# Altium project Robin_v0.PrjPcb
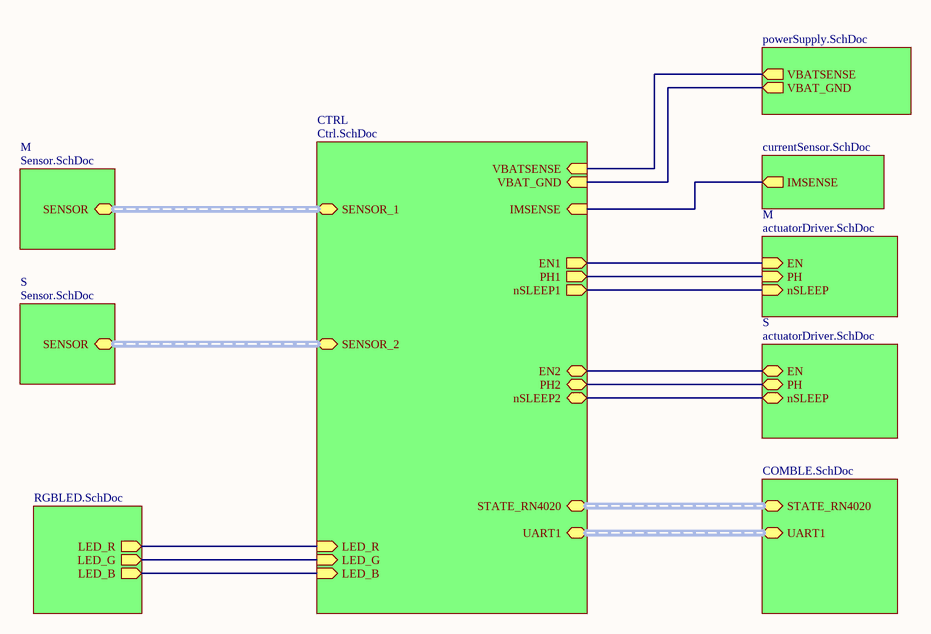
[diagram p0: Robin_v0.SchDoc]
8 sheets, 106 parts. Net scope: hierarchical (ports join the sheet entries above them; power ports are global).
Board files: PCB1.PcbDoc, PCB2.PcbDoc
Sheets:
  Robin_v0.SchDoc
    CTRL = Ctrl.SchDoc
     = powerSupply.SchDoc
    M = actuatorDriver.SchDoc
    S = actuatorDriver.SchDoc
    S = Sensor.SchDoc
    M = Sensor.SchDoc
     = COMBLE.SchDoc
     = currentSensor.SchDoc
     = RGBLED.SchDoc

## Sheet Robin_v0.SchDoc
size A4

### Sub-sheets
CTRL = Ctrl.SchDoc: STATE_RN4020 (harness STATE_RN4020), VBATSENSE (in), VBAT_GND (in), EN1 (out), PH1 (out), nSLEEP1 (out), EN2, PH2, nSLEEP2, IMSENSE (in), UART1 (harness UART1), SENSOR_1 (harness SENSOR_1), SENSOR_2 (harness SENSOR_2), LED_R (in), LED_B (in), LED_G (in)
M = actuatorDriver.SchDoc: EN (in), PH (in), nSLEEP (in)
M = Sensor.SchDoc: SENSOR (harness SENSOR_1)
S = actuatorDriver.SchDoc: EN, PH, nSLEEP
S = Sensor.SchDoc: SENSOR (harness SENSOR_2)
? = powerSupply.SchDoc: VBATSENSE (out), VBAT_GND (out)
? = COMBLE.SchDoc: STATE_RN4020 (harness STATE_RN4020), UART1 (harness UART1)
? = currentSensor.SchDoc: IMSENSE (out)
? = RGBLED.SchDoc: LED_R (out), LED_G (out), LED_B (out)

### Nets
EN: sheet CTRL/EN1, sheet M/EN
EN: sheet CTRL/EN2, sheet S/EN  [a separate net that carries the same name]
IMSENSE: sheet CTRL/IMSENSE, sheet /IMSENSE
LED_B: sheet CTRL/LED_B, sheet /LED_B
LED_G: sheet CTRL/LED_G, sheet /LED_G
LED_R: sheet CTRL/LED_R, sheet /LED_R
nSLEEP: sheet CTRL/nSLEEP1, sheet M/nSLEEP
nSLEEP: sheet CTRL/nSLEEP2, sheet S/nSLEEP  [a separate net that carries the same name]
PH: sheet CTRL/PH1, sheet M/PH
PH: sheet CTRL/PH2, sheet S/PH  [a separate net that carries the same name]
VBAT_GND: sheet CTRL/VBAT_GND, sheet /VBAT_GND
VBATSENSE: sheet CTRL/VBATSENSE, sheet /VBATSENSE

### Buses and harness runs
harness sheet /STATE_RN4020 = sheet CTRL/STATE_RN4020
harness sheet /UART1 = sheet CTRL/UART1
harness sheet CTRL/SENSOR_1 = sheet M/SENSOR
harness sheet CTRL/SENSOR_2 = sheet S/SENSOR

## Sheet Ctrl.SchDoc
size A4
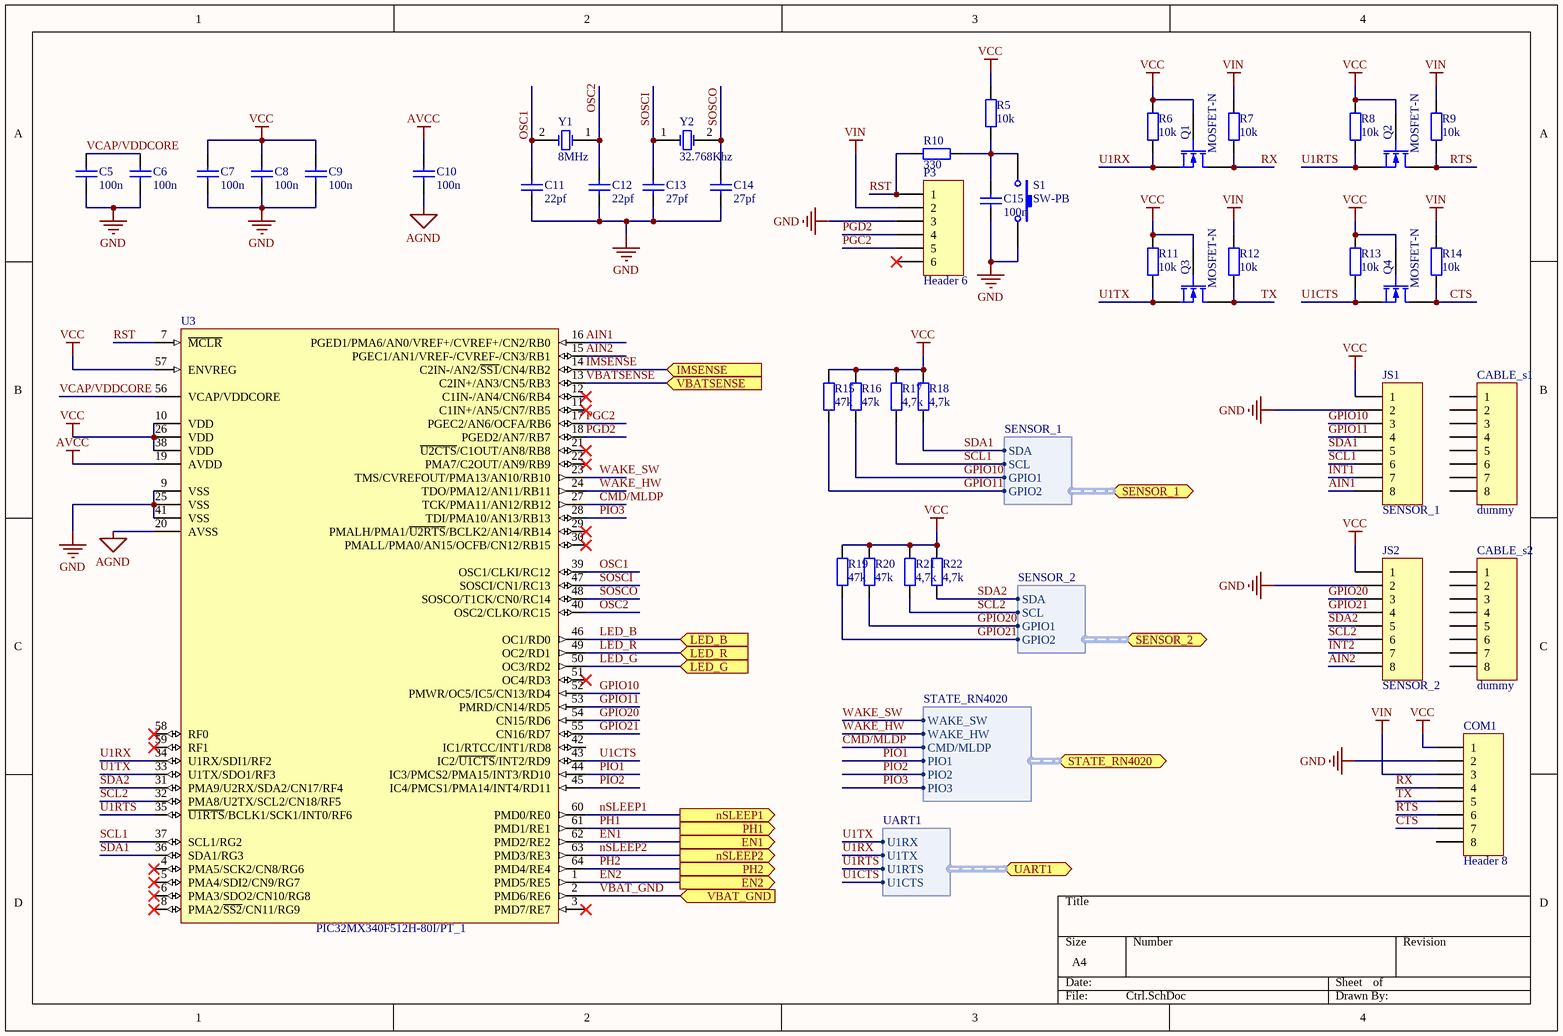
[diagram p1: Ctrl.SchDoc]

### Parts
C5  100n  [RES 0603/1608]
C6  100n  [RES 0603/1608]
C7  100n  [RES 0603/1608]
C8  100n  [RES 0603/1608]
C9  100n  [RES 0603/1608]
C10  100n  [RES 0603/1608]
C11  22pf  [RES 0603/1608]
C12  22pf  [RES 0603/1608]
C13  27pf  [RES 0603/1608]
C14  27pf  [RES 0603/1608]
C15  100n  [RES 0603/1608]
CABLE_s1  dummy
CABLE_s2  dummy
COM1  Header 8  [7-215460-8]
JS1  SENSOR_1  [7-215460-8]
JS2  SENSOR_2  [7-215460-8]
P3  Header 6  [HDR1X6]
Q1  MOSFET-N  [SOT-23]
Q2  MOSFET-N  [SOT-23]
Q3  MOSFET-N  [SOT-23]
Q4  MOSFET-N  [SOT-23]
R5  10k  [RES 0603/1608]
R6  10k  [RES 0603/1608]
R7  10k  [RES 0603/1608]
R8  10k  [RES 0603/1608]
R9  10k  [RES 0603/1608]
R10  330  [RES 0603/1608]
R11  10k  [RES 0603/1608]
R12  10k  [RES 0603/1608]
R13  10k  [RES 0603/1608]
R14  10k  [RES 0603/1608]
R15  47k  [RES 0603/1608]
R16  47k  [RES 0603/1608]
R17  4,7k  [RES 0603/1608]
R18  4,7k  [RES 0603/1608]
R19  47k  [RES 0603/1608]
R20  47k  [RES 0603/1608]
R21  4,7k  [RES 0603/1608]
R22  4,7k  [RES 0603/1608]
S1  SW-PB  [Button]
U3  PIC32MX340F512H-80I/PT_1  [TSQFP50P1200X1200X120-64N]
Y1  8MHz  [XTAL_HC-49/SM]
Y2  32.768Khz  [XTAL_AB26T]

### Ports
EN1 (out), EN2 (out), IMSENSE (in), LED_B (in), LED_G (in), LED_R (in), nSLEEP1 (out), nSLEEP2 (out), PH1 (out), PH2 (out), SENSOR_1 (harness SENSOR_1), SENSOR_2 (harness SENSOR_2), STATE_RN4020 (harness STATE_RN4020), UART1 (harness UART1), VBAT_GND (in), VBATSENSE (in)

### Harnesses
SENSOR_1: SDA, SCL, GPIO1, GPIO2
SENSOR_2: SDA, SCL, GPIO1, GPIO2
STATE_RN4020: WAKE_SW, CMD/MLDP, WAKE_HW, PIO1, PIO3, PIO2
UART1: U1RX, U1TX, U1RTS, U1CTS

### Nets
AGND: C10.2 U3.20(AVSS)
AVCC: C10.1 U3.19(AVDD)
GND: C5.2 C6.2 C7.2 C8.2 C9.2 C11.2 C12.2 C13.2 C14.2 C15.2 COM1.2 JS1.2 JS2.2 P3.3 S1.2 U3.9(VSS) U3.25(VSS) U3.41(VSS)
VCC: C7.1 C8.1 C9.1 COM1.1 JS1.1 JS2.1 Q1.2(G) Q2.2(G) Q3.2(G) Q4.2(G) R5.2 R6.2 R8.2 R11.2 R13.2 R15.2 R16.2 R17.2 R18.2 R19.2 R20.2 R21.2 R22.2 U3.10(VDD) U3.26(VDD) U3.38(VDD) U3.57(ENVREG)
VIN: COM1.3 P3.2 R7.2 R9.2 R12.2 R14.2
AIN1: JS1.8 U3.16(PGED1/PMA6/AN0/VREF+/CVREF+/CN2/RB0)
AIN2: JS2.8 U3.15(PGEC1/AN1/VREF-/CVREF-/CN3/RB1)
CMD/MLDP: U3.27(TCK/PMA11/AN12/RB12) ; port STATE_RN4020.CMD/MLDP
CTS: COM1.7 Q4.1(D) R14.1
EN1: U3.62(PMD2/RE2) ; port EN1  [project net EN]
EN2: U3.1(PMD5/RE5) ; port EN2  [project net EN]
GPIO10: JS1.3 R16.1 U3.52(PMWR/OC5/IC5/CN13/RD4) ; port SENSOR_1.GPIO1
GPIO11: JS1.4 R15.1 U3.53(PMRD/CN14/RD5) ; port SENSOR_1.GPIO2
GPIO20: JS2.3 R20.1 U3.54(CN15/RD6) ; port SENSOR_2.GPIO1
GPIO21: JS2.4 R19.1 U3.55(CN16/RD7) ; port SENSOR_2.GPIO2
IMSENSE: U3.14(C2IN-/AN2/~{SS1}/CN4/RB2) ; port IMSENSE
INT1: JS1.7
INT2: JS2.7
LED_B: U3.46(OC1/RD0) ; port LED_B
LED_G: U3.50(OC3/RD2) ; port LED_G
LED_R: U3.49(OC2/RD1) ; port LED_R
nSLEEP1: U3.60(PMD0/RE0) ; port nSLEEP1  [project net nSLEEP]
nSLEEP2: U3.63(PMD3/RE3) ; port nSLEEP2  [project net nSLEEP]
OSC1: C11.1 U3.39(OSC1/CLKI/RC12) Y1.2(OSC2)
OSC2: C12.1 U3.40(OSC2/CLKO/RC15) Y1.1(OSC1)
PGC2: P3.5 U3.17(PGEC2/AN6/OCFA/RB6)
PGD2: P3.4 U3.18(PGED2/AN7/RB7)
PH1: U3.61(PMD1/RE1) ; port PH1  [project net PH]
PH2: U3.64(PMD4/RE4) ; port PH2  [project net PH]
PIO1: U3.44(IC3/PMCS2/PMA15/INT3/RD10) ; port STATE_RN4020.PIO1
PIO2: U3.45(IC4/PMCS1/PMA14/INT4/RD11) ; port STATE_RN4020.PIO2
PIO3: U3.28(TDI/PMA10/AN13/RB13) ; port STATE_RN4020.PIO3
RST: P3.1 R10.1 U3.7(~{MCLR})
RTS: COM1.6 Q2.1(D) R9.1
RX: COM1.4 Q1.1(D) R7.1
SCL1: JS1.6 R17.1 U3.37(SCL1/RG2) ; port SENSOR_1.SCL
SCL2: JS2.6 R21.1 U3.32(PMA8/U2TX/SCL2/CN18/RF5) ; port SENSOR_2.SCL
SDA1: JS1.5 R18.1 U3.36(SDA1/RG3) ; port SENSOR_1.SDA
SDA2: JS2.5 R22.1 U3.31(PMA9/U2RX/SDA2/CN17/RF4) ; port SENSOR_2.SDA
SOSCI: C13.1 U3.47(SOSCI/CN1/RC13) Y2.1(OSC1)
SOSCO: C14.1 U3.48(SOSCO/T1CK/CN0/RC14) Y2.2(OSC2)
TX: COM1.5 Q3.1(D) R12.1
U1CTS: Q4.3(S) R13.1 U3.43(IC2/~{U1CTS}/INT2/RD9) ; port UART1.U1CTS
U1RTS: Q2.3(S) R8.1 U3.35(~{U1RTS}/BCLK1/SCK1/INT0/RF6) ; port UART1.U1RTS
U1RX: Q1.3(S) R6.1 U3.34(U1RX/SDI1/RF2) ; port UART1.U1TX
U1TX: Q3.3(S) R11.1 U3.33(U1TX/SDO1/RF3) ; port UART1.U1RX
VBAT_GND: U3.2(PMD6/RE6) ; port VBAT_GND
VBATSENSE: U3.13(C2IN+/AN3/CN5/RB3) ; port VBATSENSE
VCAP/VDDCORE: C5.1 C6.1 U3.56(VCAP/VDDCORE)
WAKE_HW: U3.24(TDO/PMA12/AN11/RB11) ; port STATE_RN4020.WAKE_HW
WAKE_SW: U3.23(TMS/CVREFOUT/PMA13/AN10/RB10) ; port STATE_RN4020.WAKE_SW
NetC15_1: C15.1 R5.1 R10.2 S1.1

Not connected (* = marked no-connect by the designer): CABLE_s1 1 2 3 4 5 6 7 8; CABLE_s2 1 2 3 4 5 6 7 8; COM1 8; P3 6*; U3 3(PMD7/RE7)* 4(PMA5/SCK2/CN8/RG6)* 5(PMA4/SDI2/CN9/RG7)* 6(PMA3/SDO2/CN10/RG8)* 8(PMA2/~{SS2}/CN11/RG9)* 11(C1IN+/AN5/CN7/RB5)* 12(C1IN-/AN4/CN6/RB4)* 21(~{U2CTS}/C1OUT/AN8/RB8)* 22(PMA7/C2OUT/AN9/RB9)* 29(PMALH/PMA1/~{U2RTS}/BCLK2/AN14/RB14)* 30(PMALL/PMA0/AN15/OCFB/CN12/RB15)* 42(IC1/RTCC/INT1/RD8) 51(OC4/RD3)* 58(RF0)* 59(RF1)*

### Library data of the parts
C5-C10 C15 = Cap: MULTICOMP  MCSH21B104K100CT  Condensateur céramique multicouche CMS, 0805 [2012 Metric], 0.1 µF, 10 V, ± 10%, X7R, Série MCSH; Fournisseur: Farnell; RefFournisseur: 1856422; Fabricant: MULTICOMP; Footprint: 0603; RefFabricant: MCSH21B104K100CT; Value: 100n
C11 C12 = Cap: Condensateur céramique multicouche CMS, 0805 [2012 Metric], 22 pF, 50 V, ± 5%, C0G / NP0; Fabricant: WALSIN; Fournisseur: Farnell; RefFournisseur: 2497023; RefFabricant: 0805N220J500CT; Footprint: 0603; Value: 22pf
C13 C14 = Cap: Condensateur céramique multicouche CMS, 0805 [2012 Metric], 27 pF, 50 V, ± 5%, C0G / NP0; Fabricant: WALSIN; Fournisseur: Farnell; RefFournisseur: 2497027; RefFabricant: 0805N270J500CT; Footprint: 0603; Value: 27pf
CABLE_s1 CABLE_s2 = Header 8: AMP - TE CONNECTIVITY  1483352-2  Câble nappe, Fiche Micro-Match, Fiche Micro-Match, 8 Voies, 6 ", 150 mm, 1.27 mm; Fournisseur: Farnell; RefFournisseur: 1056214; Fabricant: AMP - TE CONNECTIVITY; RefFabricant: 1483352-2
COM1 JS1 JS2 = Header 8: AMP - TE CONNECTIVITY  7-215460-8  Connecteur carte-à-carte, Entrée latérale, 1.27 mm, 8 Contact(s), Embase, Série Micro-MaTch; Fournisseur: Farnell; RefFournisseur: 148751; RefFabricant: 7-215460-8; Fabricant: AMP - TE CONNECTIVITY
P3 = Header 6: Header, 6-Pin; Fournisseur: Farnell; RefFournisseur: 2356158; Fabricant: WURTH ELEKTRONIK; RefFabricant: 61300611121; Footprint: pin header 2.54mm
Q1-Q4 = MOSFET-N: Transistor MOSFET, Canal N, 200 mA, 60 V, 2.7 ohm, 10 V, 1.2 V; Fournisseur: Farnell; RefFournisseur: 2357125; Fabricant: NEXPERIA; RefFabricant: BSS138AKA
R5-R9 R11-R14 = Res2: Résistance à puce CMS, Couche épaisse, 10 kohm, 150 V, 0805; Fournisseur: Farnell; Fabricant: TE CONNECTIVITY; refFabricant: CRGH0805J10K; RefFournisseur: 2331808; Value: 10k; Footprint: 0603
R10 = Res2: ARCOL/OHMITE  ACPP0805330RBE  Résistance à puce CMS, Passivée de précision, 330 ohm, 100 V, 0805 [2012 Metric], 100 mW, ± 0.1%; Fournisseur: Farnell; RefFournisseur: 2504974; Value: 330; Fabricant: ARCOL/OHMITE; refFabricant: ACPP0805330RBE; Footprint: 0603
R15 R16 R19 R20 = Res2: Résistance à puce CMS, Couche épaisse, 47 kohm, 150 V, 0805 [2012 Metric], 125 mW, ± 1%, Série RC; Fournisseur: Farnell; Fabricant: YAGEO (PHYCOMP); refFabricant: RC0805FR-0747KL; RefFournisseur: 9237836; Value: 47k; Footprint: 0603
R17 R18 R21 R22 = Res2: Résistance à puce CMS, Couche épaisse, 4.7 kohm, 150 V, 0805 [2012 Metric], 125 mW, ± 5%, Série RC; Fournisseur: Farnell; Fabricant: YAGEO (PHYCOMP); refFabricant: RC0805JR-074K7L; RefFournisseur: 9234098; Value: 4,7k
  R17 R21 R22: Footprint: 0603
  R18: Footprint: 0805
S1 = SW-PB: Commutateur tactile, Non lumineux, 12 V, 50 mA, 100 gf, CMS, Série DTSZML-6; RefFournisseur: 2396053; RefFabricant: MC32882; Fabricant: MULTICOMP; Fournisseur: Farnell
U3 = PIC32MX340F512H-80I/PT_1: High Performance 80 MHz MIPS-Based 32-Bit Flash Microcontroller, 512KB Program Memory, 64-pin TQFP; Fournisseur: Farnell; Fabricant: Microchip; RefFournisseur: 1677915; RefFabricant: PIC32MX340F512H-80I/PT
Y1 = XTAL: MULTICOMP  HC49SM-8-30-50-60-16-ATF  Cristal, 8 MHz, CMS, 11.4mm x 4.65mm, 50 ppm, 16 pF, 30 ppm, Série HC49SM; Fournisseur: Farnell; RefFournisseur: 1667012; Fabricant: MULTICOMP; RefFabricant: HC49SM-8-30-50-60-16-ATF; value: 8MHz
Y2 = XTAL: ABRACON  AB26T-32.768KHZ  Cristal, 32.768 kHz, Cylindrique radial, diamètre 6.2mm x 2.1mm, 12.5 pF, 20 ppm, Série AB26T; Fournisseur: Farnell; RefFournisseur: 2467704; RefFabricant: AB26T-32.768KHZ; Fabricant: ABRACON; value: 32.768Khz

## Sheet powerSupply.SchDoc
size A4
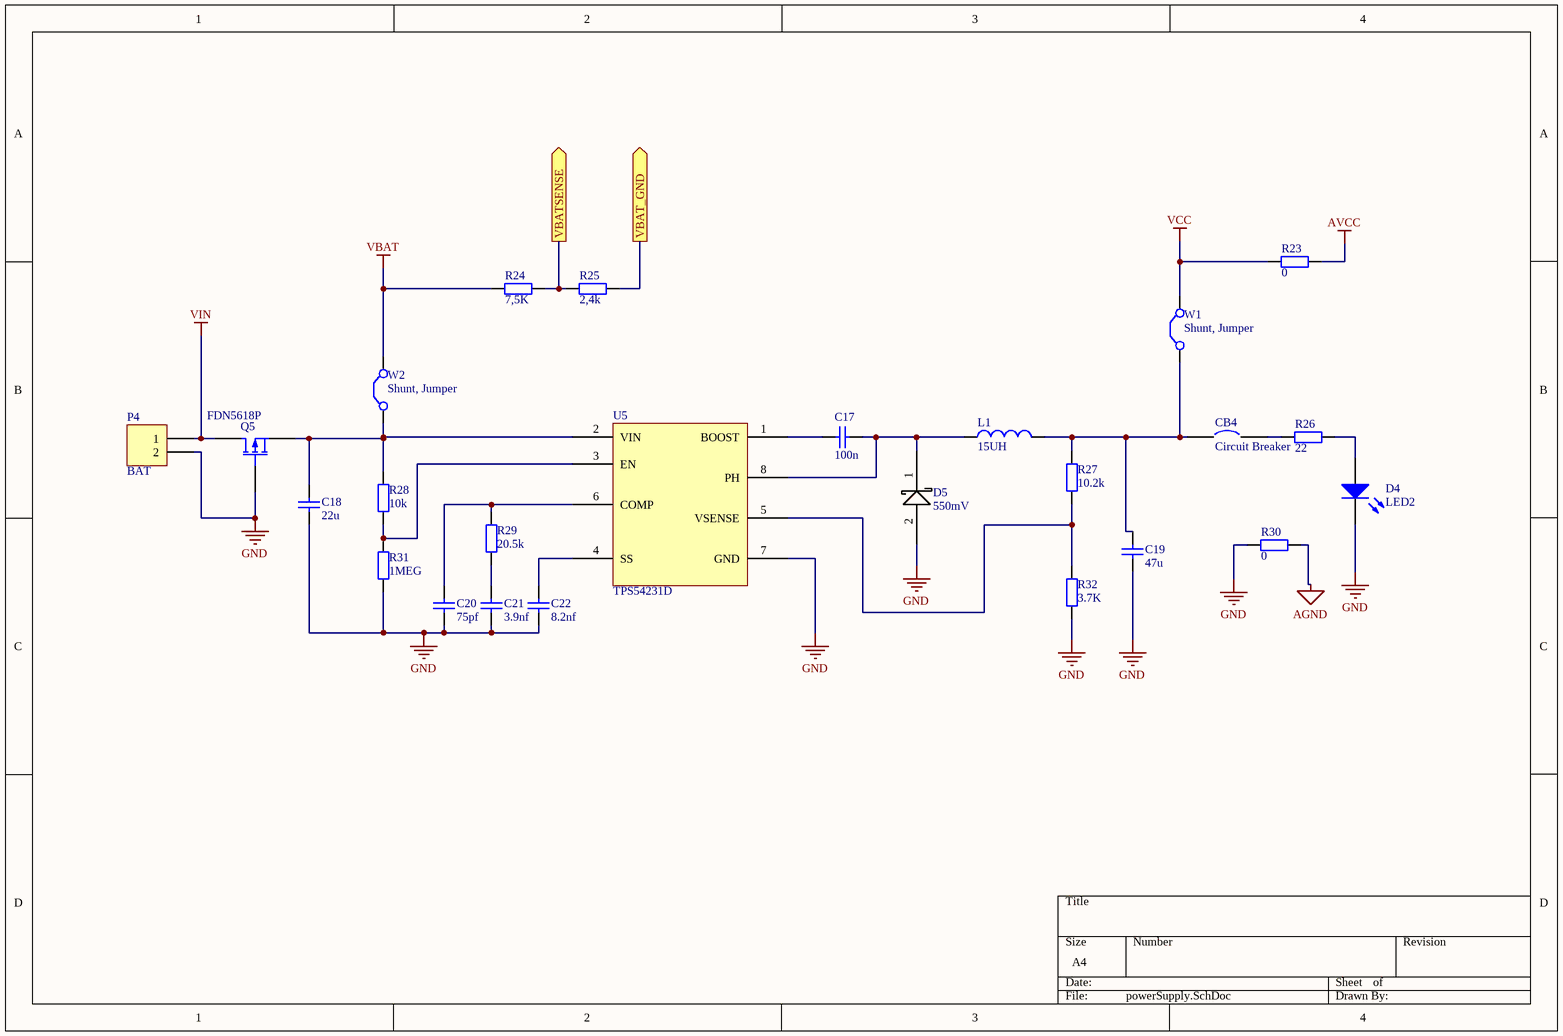
[diagram p2: powerSupply.SchDoc]

### Parts
C17  100n  [CAP 0603/1608]
C18  22u  [CAP 0603/1608]
C19  47u  [CAP 1210/3225 - 2.5MM]
C20  75pf  [CAP 0603/1608]
C21  3.9nf  [CAP 0603/1608]
C22  8.2nf  [CAP 0603/1608]
CB4  Circuit Breaker  [JUMPER PAD]
D4  LED2  [LED 0603/1608 BLUE]
D5  550mV  [microSMA]
L1  15UH  [SRN6045-3R3Y]
P4  BAT  [HDR1X2]
Q5  FDN5618P  [SOT-23_M]
R23  0  [RES 0603/1608]
R24  7,5K  [RES 0603/1608]
R25  2,4k  [RES 0603/1608]
R26  22  [RES 0603/1608]
R27  10.2k  [RES 0603/1608]
R28  10k  [RES 0603/1608]
R29  20.5k  [RES 0603/1608]
R30  0  [RES 0603/1608]
R31  1MEG  [RES 0603/1608]
R32  3.7K  [RES 0603/1608]
U5  TPS54231D  [SOIC8]
W1  Shunt, Jumper  [HDR1X2]
W2  Shunt, Jumper  [HDR1X2]

### Ports
VBAT_GND (out), VBATSENSE (out)

### Nets
AGND: R30.2
AVCC: R23.2
GND: C18.2 C19.2 C20.2 C21.2 C22.2 D4.2(K) D5.2 P4.2 Q5.2(G) R30.1 R31.1 R32.1 U5.7(GND)
VBAT: R24.2 W2.2(C2)
VCC: R23.1 W1.2(C2)
VIN: P4.1 Q5.1(D)
VBAT_GND: R25.1 ; port VBAT_GND
VBATSENSE: R24.1 R25.2 ; port VBATSENSE
NetC17_1: C17.1 U5.1(BOOST)
NetC17_2: C17.2 D5.1 L1.1 U5.8(PH)
NetC18_1: C18.1 Q5.3(S) R28.2 U5.2(VIN) W2.1(C1)
NetC19_1: C19.1 CB4.1 L1.2 R27.2 W1.1(C1)
NetC20_1: C20.1 R29.2 U5.6(COMP)
NetC21_1: C21.1 R29.1
NetC22_1: C22.1 U5.4(SS)
NetCB4_2: CB4.2 R26.1
NetD4_1: D4.1(A) R26.2
NetR27_1: R27.1 R32.2 U5.5(VSENSE)
NetR28_1: R28.1 R31.2 U5.3(EN)

### Library data of the parts
C17 = Cap: AVX  08053C104KAT2A  Condensateur céramique multicouche CMS, 0805 [2012 Metric], 0.1 µF, 25 V, ± 10%, X7R; Fournisseur: Farnell; RefFournisseur: 1740665; Fabricant: AVX; Footprint: 0603; RefFabricant: 08053C104KAT2A; Value: 100n
C18 C20-C22 = Cap: Fabricant: MURATA; Fournisseur: Farnell; Footprint: 0603
  C18: Value: 22u
  C20: Value: 75pf
  C21: Value: 3.9nf
  C22: Value: 8.2nf
C19 = Cap: Condensateur céramique multicouche CMS, 1210 [3225 Metric], 47 µF, 16 V, ± 20%, X5R, Série GRM; Fabricant: KEMET; Fournisseur: Farnell; RefFournisseur: 1572639; RefFabricant: C1206C476M8PACTU; Footprint: 1210; Value: 47u
D4 = LED2: LED, Bleu, CMS, 0.8mm x 1.6mm, 5 mA, 2.9 V, 470 nm; Fournisseur: Farnell; Fabrican: PANASONIC ELECTRONIC COMPONENTS; RefFabricant: LNJ926W8CRA; RefFournisseur: 1908050; Footprint: 0603
D5 = schottky: TAIWAN SEMICONDUCTOR  SS14M  Redresseur Schottky, 40 V, 1 A, Une, MicroSMA, 2 Broche(s), 550 mV; refFournisseur: 1863139; Fournisseur: farnell; refFabricant: SS14M; Fabricant: TAIWAN SEMICONDUCTOR; value: 550mV
L1 = Inductor: BOURNS  SRN6045-150M  Inductance de puissance CMS, 15 µH, 1.9 A, 2.3 A, Blindé, 0.0958 ohm; Fournisseur: Farnell; RefFournisseur: 2061653; fabricant: BOURNS; RefFabricant: SRN6045-150M; value: 15UH
P4 = Header 2: Header, 2-Pin; LatestRevisionDate: 17-Jul-2002; LatestRevisionNote: Re-released for DXP Platform.; Publisher: Altium Limited
Q5 = MOSFET-P: Transistor MOSFET, Canal P, -1.25 A, -60 V, 170 mohm, -10 V, 20 V; Fournisseur: Farnell; RefFournisseur: 9846344; Fabricant: FAIRCHILD SEMICONDUCTOR; RefFabricant: FDN5618P; Footprint: SuperSOT-3
R23 R30 = Res2: MULTICOMP  MC0805S8F0000T5E  Résistance à puce CMS, Couche épaisse, 0 ohm, 150 V, 0805 [2012 Metric], 125 mW, ± 1%, Série MC; Fournisseur: Farnell; RefFournisseur: 2309112; Value: 0; Fabricant: MULTICOMP; refFabricant: MC0805S8F0000T5E; Footprint: 0603
R24 = Res2: PANASONIC ELECTRONIC COMPONENTS  ERJ6GEYJ752V  Résistance à puce CMS, Couche épaisse, 7.5 kohm, 150 V, 0805 [2012 Metric], 125 mW, ± 5%; RefFournisseur: 2323866; Fournisseur: Farnell; RefFabricant: ERJ6GEYJ752V; Fabricant: PANASONIC ELECTRONIC COMPONENTS; Value: 7,5K; Footprint: 0603
R25 = Res2: YAGEO (PHYCOMP)  RC0805FR-0710KL  Résistance à puce CMS, Couche épaisse, 10 kohm, 150 V, 0805 [2012 Metric], 125 mW, ± 1%, Série RC; RefFabricant: ERJ6GEYJ242V; RefFournisseur: 2323829; Fabricant: PANASONIC ELECTRONIC COMPONENTS; Fournisseur: Farnell; Value: 2,4k; Footprint: 0603
R26 R28 R29 R31 = Res2: Fournisseur: Farnell; Fabricant: YAGEO (PHYCOMP); Footprint: 0603
  R26: Value: 22
  R28: Value: 10k
  R29: Value: 20.5k
  R31: Value: 1MEG
R27 = Res2: Fournisseur: Farnell; Value: 10.2k; Footprint: 0603
R32 = Res2: Value: 3.7K
U5 = TPS54231D: TEXAS INSTRUMENTS  TPS54231D  Régulateur DC/DC à découpage Buck (Step Down), Ajustable, 3.5V-28Vin, 800mV-25Vout, 2Aout, SOIC-8; Fournisseur: farnell; refFournisseur: 1755637; Fabricant: Texas Instrument; refFabricant: TPS54231D
W1 W2 = Jumper: Jumper Socket, Pin Headers, 2 Voies, 1.27 mm; Fabricant: SAMTEC; Fournisseur: Farnell; RefFabricant: SNT-100-BK-T-H; RefFournisseur: 1803187; Footprint: Pin Headers 2.54 mm

## Sheet actuatorDriver.SchDoc
size A4
Used 2 times, as channels M, S. Parts and nets are listed once, with the designators drawn on the sheet.
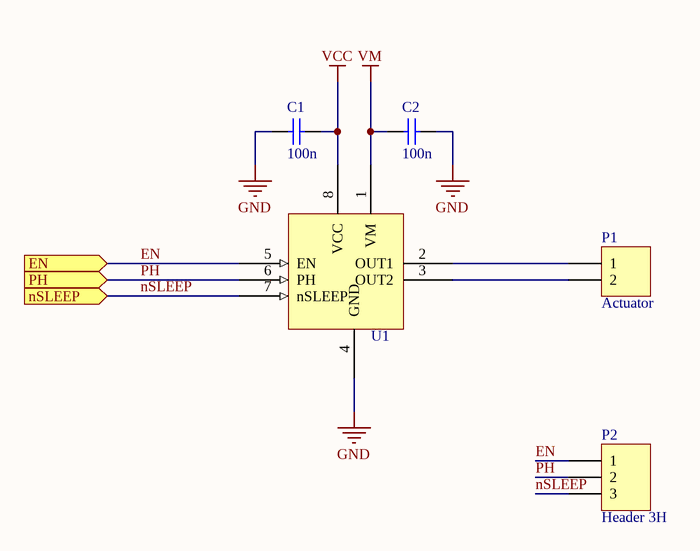
[diagram p3: actuatorDriver.SchDoc]

### Parts
C1  100n  [CAP 0603/1608]
C2  100n  [CAP 0603/1608]
P1  Actuator  [HDR1X2]
P2  Header 3H  [HDR1X3]
U1  DRV8838  [S-PWSON-N8]  (value not drawn)

### Ports
EN (in), nSLEEP (in), PH (in)

### Nets
GND: C1.2 C2.1 U1.4(GND)
VCC: C1.1 U1.8(VCC)
VM: C2.2 U1.1(VM)
EN: P2.1 U1.5(EN) ; port EN
nSLEEP: P2.3 U1.7(nSLEEP) ; port nSLEEP
PH: P2.2 U1.6(PH) ; port PH
NetP1_1: P1.1 U1.2(OUT1)
NetP1_2: P1.2 U1.3(OUT2)

### Channels
M: designators end in _M; ports EN=EN nSLEEP=nSLEEP PH=PH
S: designators end in _S; ports EN=EN nSLEEP=nSLEEP PH=PH

### Library data of the parts
C1 C2 = Cap: as C5 on sheet Ctrl; Fabricant: MULTICOMP; Footprint: 0603; RefFabricant: MCSH21B104K100CT; Value: 100n
P1 = Header 2: Header, 2-Pin; LatestRevisionDate: 17-Jul-2002; LatestRevisionNote: Re-released for DXP Platform.; Publisher: Altium Limited
P2 = Header 3H: WURTH ELEKTRONIK  61300611121  Connecteur carte-à-carte, Vertical, 2.54 mm, 6 Contact(s), Embase, Série WR-PHD, Traversant; Fournisseur: Farnell; RefFournisseur: 2356158; Fabricant: WURTH ELEKTRONIK; RefFabricant: 61300611121
U1 = DRV8838: Moteur Driver [H - bridge]; Fabricant: Texas instrument; Fournisseur: farnell; RefFournisseur: 2420232; RefFabricant: DRV8838DSGT

## Sheet Sensor.SchDoc
size A4
Used 2 times, as channels S, M. Parts and nets are listed once, with the designators drawn on the sheet.
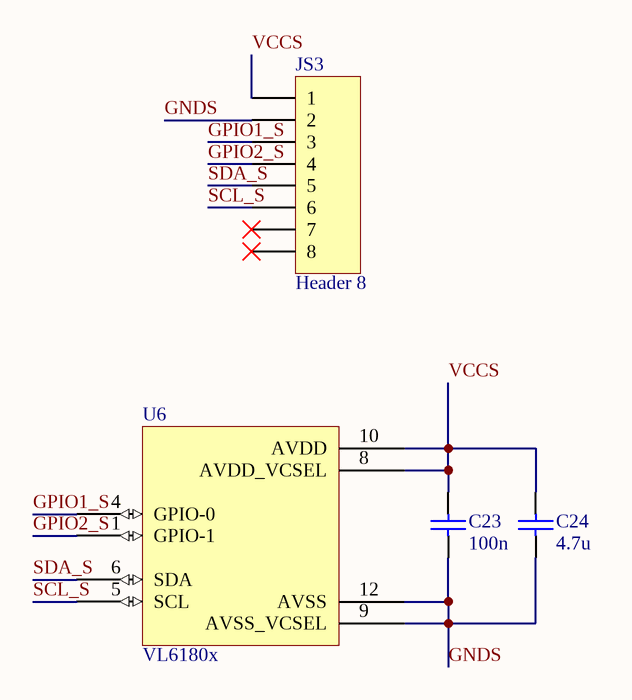
[diagram p4: Sensor.SchDoc]

### Parts
C23  100n  [RES 0603/1608]
C24  4.7u  [CAP 0603/1608]
JS3  Header 8  [7-215464-8]
U6  VL6180x  [LGA12]

### Nets
GNDS: C23.2 C24.1 JS3.2 U6.9(AVSS_VCSEL) U6.12(AVSS)
GPIO1_S: JS3.3 U6.4(GPIO-0)
GPIO2_S: JS3.4 U6.1(GPIO-1)
SCL_S: JS3.6 U6.5(SCL)
SDA_S: JS3.5 U6.6(SDA)
VCCS: C23.1 C24.2 JS3.1 U6.8(AVDD_VCSEL) U6.10(AVDD)

Not connected (* = marked no-connect by the designer): JS3 7* 8*

### Channels
S: designators end in _S
M: designators end in _M

### Library data of the parts
C23 = Cap: as C5 on sheet Ctrl; Fabricant: MULTICOMP; Footprint: 0603; RefFabricant: MCSH21B104K100CT; Value: 100n
C24 = Cap: WALSIN  0603X475K6R3CT  Condensateur céramique multicouche CMS, 0603 [1608 Metric], 4.7 µF, 6.3 V, ± 10%, X5R; Fournisseur: Farnell; RefFournisseur: 2496930; Fabricant: WALSIN; Footprint: 0603 [1608 Metric]; RefFabricant: 0603X475K6R3CT; Value: 4.7u
JS3 = Header 8: as COM1 on sheet Ctrl; Fabricant: AMP - TE CONNECTIVITY; RefFournisseur: 7-215460-8; Footprint: 7-215460-8
U6 = VL6180x: STMICROELECTRONICS  VL6180XV0NR/1  Capteur de proximité, Numérique, 100 mm, LGA, 12 Broche(s), 2.6 V, 3 V; RefFournisseur: 2462820; Fournisseur: Farnell; Fabricant: STmicroelectronics; RefFabricant: VL6180XV0NR/1

## Sheet COMBLE.SchDoc
size A4
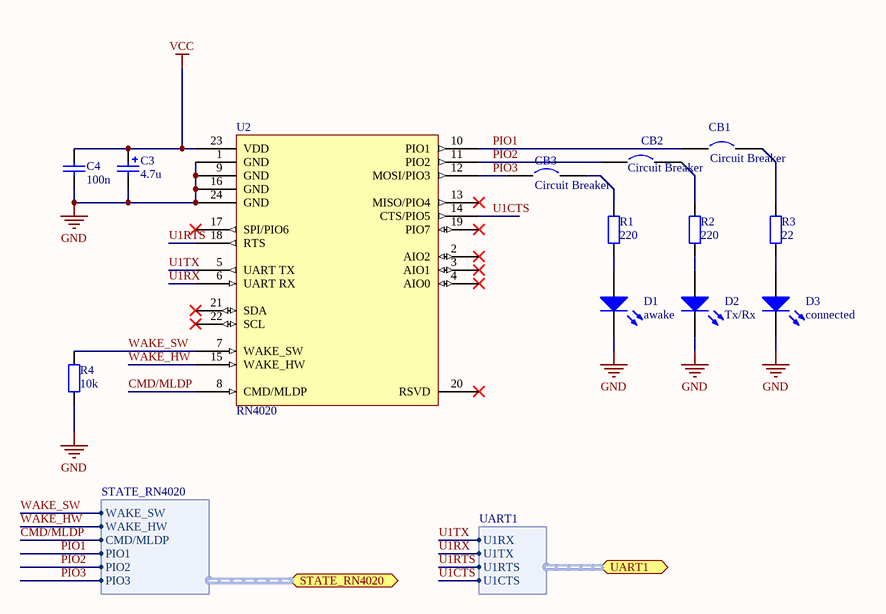
[diagram p5: COMBLE.SchDoc]

### Parts
C3  4.7u  [CAP POL 1206/3216 - 1.2MM]
C4  100n  [RES 0603/1608]
CB1  Circuit Breaker  [JUMPER PAD]
CB2  Circuit Breaker  [JUMPER PAD]
CB3  Circuit Breaker  [JUMPER PAD]
D1  awake  [LED 0603/1608 BLUE]
D2  Tx/Rx  [LED 0603/1608 BLUE]
D3  connected  [LED 0603/1608 BLUE]
R1  220  [RES 0603/1608]
R2  220  [RES 0603/1608]
R3  22  [RES 0603/1608]
R4  10k  [RES 0603/1608]
U2  RN4020  [RN4020]

### Ports
STATE_RN4020 (harness STATE_RN4020), UART1 (harness UART1)

### Harnesses
STATE_RN4020: WAKE_SW, CMD/MLDP, WAKE_HW, PIO1, PIO3, PIO2
UART1: U1RX, U1TX, U1RTS, U1CTS

### Nets
GND: C3.2 C4.2 D1.2(K) D2.2(K) D3.2(K) R4.2 U2.1(GND) U2.9(GND) U2.16(GND) U2.24(GND)
VCC: C3.1 C4.1 U2.23(VDD)
CMD/MLDP: U2.8(CMD/MLDP) ; port STATE_RN4020.CMD/MLDP
PIO1: CB1.1 U2.10(PIO1) ; port STATE_RN4020.PIO1
PIO2: CB2.1 U2.11(PIO2) ; port STATE_RN4020.PIO2
PIO3: CB3.1 U2.12(MOSI/PIO3) ; port STATE_RN4020.PIO3
U1CTS: U2.14(CTS/PIO5) ; port UART1.U1CTS
U1RTS: U2.18(RTS) ; port UART1.U1RTS
U1RX: U2.6(UART_RX) ; port UART1.U1TX
U1TX: U2.5(UART_TX) ; port UART1.U1RX
WAKE_HW: U2.15(WAKE_HW) ; port STATE_RN4020.WAKE_HW
WAKE_SW: R4.1 U2.7(WAKE_SW) ; port STATE_RN4020.WAKE_SW
NetCB1_2: CB1.2 R3.2
NetCB2_2: CB2.2 R2.2
NetCB3_2: CB3.2 R1.2
NetD1_1: D1.1(A) R1.1
NetD2_1: D2.1(A) R2.1
NetD3_1: D3.1(A) R3.1

Not connected (* = marked no-connect by the designer): U2 2(AIO2)* 3(AIO1)* 4(AIO0)* 13(MISO/PIO4)* 17(SPI/PIO6)* 19(PIO7)* 20(RSVD)* 21(SDA)* 22(SCL)*

### Library data of the parts
C3 = Cap Pol2: Condensateur tantale CMS, 4.7 µF, 10 V, Série T491, ± 10%; Fournisseur: Farnell; Fabricant: KEMET; RefFabricant: T491A475K010AT; RefFournisseur: 1457427; value: 4.7u; Footprint: 1206 [3216 Metric]
C4 = Cap: as C5 on sheet Ctrl; Fabricant: MULTICOMP; Footprint: 0603; RefFabricant: MCSH21B104K100CT; Value: 100n
D1 D2 = LED2: LED, Ambre, CMS, 0.8mm x 1.1mm, 5 mA, 1.95 V, 590 nm; Fournisseur: Farnell; Fabrican: PANASONIC ELECTRONIC COMPONENTS; RefFabricant: LNJ437W84RA; RefFournisseur: 1908055; Footprint: 0603
D3 = LED2: as D4 on sheet powerSupply; Footprint: 0603
R1 R2 = Res2: YAGEO (PHYCOMP)  RC0805FR-07220RL  Résistance à puce CMS, Couche épaisse, 220 ohm, 150 V, 0805 [2012 Metric], 125 mW, ± 1%, Série RC; Fournisseur: Farnell; RefFournisseur: 9237402; Value: 220; Fabricant: YAGEO (PHYCOMP); refFabricant: RC0805FR-07220RL; Footprint: 0603
R3 = Res2: YAGEO (PHYCOMP)  RC0805FR-0722RL  Résistance à puce CMS, Couche épaisse, 22 ohm, 150 V, 0805 [2012 Metric], 125 mW, ± 1%, Série RC; Fournisseur: Farnell; RefFournisseur: 9237283; Value: 22; Fabricant: YAGEO (PHYCOMP); refFabricant: RC0805FR-0722RL; Footprint: 0603
R4 = Res2: as R5 on sheet Ctrl; Value: 10k; Footprint: 0603
U2 = RN4020: MICROCHIP  RN4020-V/RM  Module Bluetooth® Low Energy v4.1, 2.4GHz à 2.48GHz, 1 MBPS; Fournisseur: Farnell; RefFournisseur: 2442930; Fabricant: microchip; RefFabricant: RN4020-V/RM

## Sheet currentSensor.SchDoc
size A4
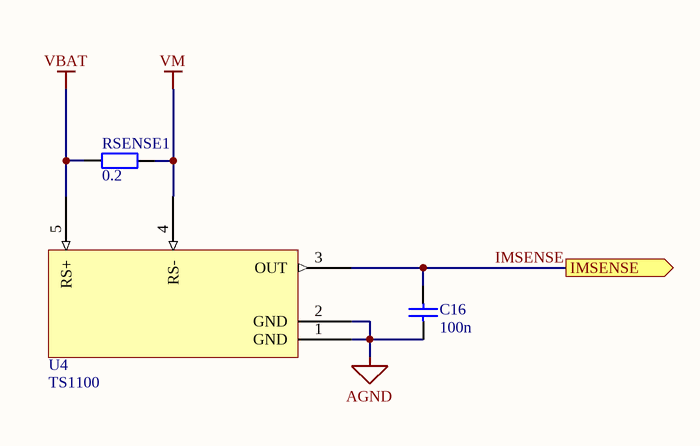
[diagram p6: currentSensor.SchDoc]

### Parts
C16  100n  [CAP 0603/1608]
RSENSE1  0.2  [RES 0603/1608]
U4  TS1100  [SOT23-5]

### Ports
IMSENSE (out)

### Nets
AGND: C16.2 U4.1(GND) U4.2(GND)
VBAT: RSENSE1.1 U4.5(RS+)
VM: RSENSE1.2 U4.4(RS-)
IMSENSE: C16.1 U4.3(OUT) ; port IMSENSE

### Library data of the parts
C16 = Cap: as C5 on sheet Ctrl; Fabricant: MULTICOMP; Footprint: 0603; RefFabricant: MCSH21B104K100CT; Value: 100n
RSENSE1 = Res2: SUSUMU  RL1220S-R20-F  Résistance CMS de détection de courant, 0.2 ohm, 250 mW, 0805 [2012 Metric], ± 1%, Série RL; RefFournisseur: 1653327; Fournisseur: Farnell; RefFabricant: RL1220S-R20-F; Fabricant: SUSUMU; Value: 0.2; Footprint: 0603
U4 = TS1100: SILICON LABS  TS1100-25EG5T  Amplificateur de mesure de courant, Précision, 1 amplificateur, SOT-23, 5 Broche(s), -40 °C, 105 °C; Fournisseur: Farnell; RefFournisseur: 2373811; Fabricant: Silicon Lab; Footprint: SOT-23 - 5; RefFabricant: TS1100-25EG5T

## Sheet RGBLED.SchDoc
size A4
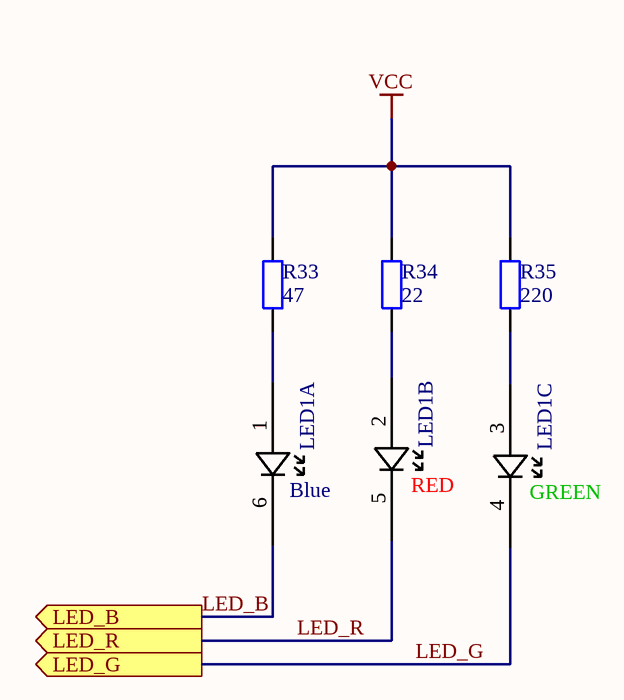
[diagram p7: RGBLED.SchDoc]

### Parts
LED1  LED_Red_Blue_Green  [SMLP36]  (value not drawn)  (parts A,B,C of 3)
R33  47  [RES 0603/1608]
R34  22  [RES 0603/1608]
R35  220  [RES 0603/1608]

### Ports
LED_B (out), LED_G (out), LED_R (out)

### Nets
VCC: R33.2 R34.2 R35.2
LED_B: LED1.6 ; port LED_B
LED_G: LED1.4 ; port LED_G
LED_R: LED1.5 ; port LED_R
NetLED1_1: LED1.1 R33.1
NetLED1_2: LED1.2 R34.1
NetLED1_3: LED1.3 R35.1

### Notes on the sheet
- (in symbol LED_Red_Blue_Green, part A) Blue
- (in symbol LED_Red_Blue_Green, part B) RED
- (in symbol LED_Red_Blue_Green, part C) GREEN

### Library data of the parts
LED1 = LED_Red_Blue_Green: PICOLED, Rouge, Vert, Bleu, CMS, Rectangulaire, R 5mA, G 5mA, B 5mA; Fournisseur: Farnell; RefFournisseur: 2507558RL; Fabricant: ROHM; RefFabricant: SMLP36RGB2W3R
R33 = Res2: YAGEO (PHYCOMP)  RC0805FR-0747RL  Résistance à puce CMS, Couche épaisse, 47 ohm, 150 V, 0805 [2012 Metric], 125 mW, ± 1%, Série RC; Fournisseur: Farnell; RefFournisseur: 9237321; Value: 47; Fabricant: YAGEO (PHYCOMP); refFabricant: RC0805FR-0747RL; Footprint: 0603
R34 = Res2: as R3 on sheet COMBLE; Value: 22; Fabricant: YAGEO (PHYCOMP); RefFabricant: RC0805FR-0722RL; Footprint: 0603
R35 = Res2: as R1 on sheet COMBLE; Value: 220; Fabricant: YAGEO (PHYCOMP); refFabricant: RC0805FR-07220RL; Footprint: 0603

## Nets that join several sheets
AGND: Ctrl (C10.2 U3.20), powerSupply (R30.2), currentSensor (C16.2 U4.1 U4.2)
AVCC: Ctrl (C10.1 U3.19), powerSupply (R23.2)
GND: Ctrl (18 pins), powerSupply (13 pins), M (C1_M.2 C2_M.1 U1_M.4), S (C1_S.2 C2_S.1 U1_S.4), COMBLE (10 pins)
VBAT: powerSupply (R24.2 W2.2), currentSensor (RSENSE1.1 U4.5)
VCC: Ctrl (27 pins), powerSupply (R23.1 W1.2), M (C1_M.1 U1_M.8), S (C1_S.1 U1_S.8), COMBLE (C3.1 C4.1 U2.23), RGBLED (R33.2 R34.2 R35.2)
VIN: Ctrl (6 pins), powerSupply (P4.1 Q5.1)
VM: M (C2_M.2 U1_M.1), S (C2_S.2 U1_S.1), currentSensor (RSENSE1.2 U4.4)
CMD/MLDP: Ctrl (U3.27), COMBLE (U2.8)
EN: Ctrl (U3.62), M (P2_M.1 U1_M.5)
EN: Ctrl (U3.1), S (P2_S.1 U1_S.5)
IMSENSE: Ctrl (U3.14), currentSensor (C16.1 U4.3)
LED_B: Ctrl (U3.46), RGBLED (LED1.6)
LED_G: Ctrl (U3.50), RGBLED (LED1.4)
LED_R: Ctrl (U3.49), RGBLED (LED1.5)
nSLEEP: Ctrl (U3.60), M (P2_M.3 U1_M.7)
nSLEEP: Ctrl (U3.63), S (P2_S.3 U1_S.7)
PH: Ctrl (U3.61), M (P2_M.2 U1_M.6)
PH: Ctrl (U3.64), S (P2_S.2 U1_S.6)
PIO1: Ctrl (U3.44), COMBLE (CB1.1 U2.10)
PIO2: Ctrl (U3.45), COMBLE (CB2.1 U2.11)
PIO3: Ctrl (U3.28), COMBLE (CB3.1 U2.12)
U1CTS: Ctrl (Q4.3 R13.1 U3.43), COMBLE (U2.14)
U1RTS: Ctrl (Q2.3 R8.1 U3.35), COMBLE (U2.18)
U1RX: Ctrl (Q1.3 R6.1 U3.34), COMBLE (U2.6)
U1TX: Ctrl (Q3.3 R11.1 U3.33), COMBLE (U2.5)
VBAT_GND: Ctrl (U3.2), powerSupply (R25.1)
VBATSENSE: Ctrl (U3.13), powerSupply (R24.1 R25.2)
WAKE_HW: Ctrl (U3.24), COMBLE (U2.15)
WAKE_SW: Ctrl (U3.23), COMBLE (R4.1 U2.7)